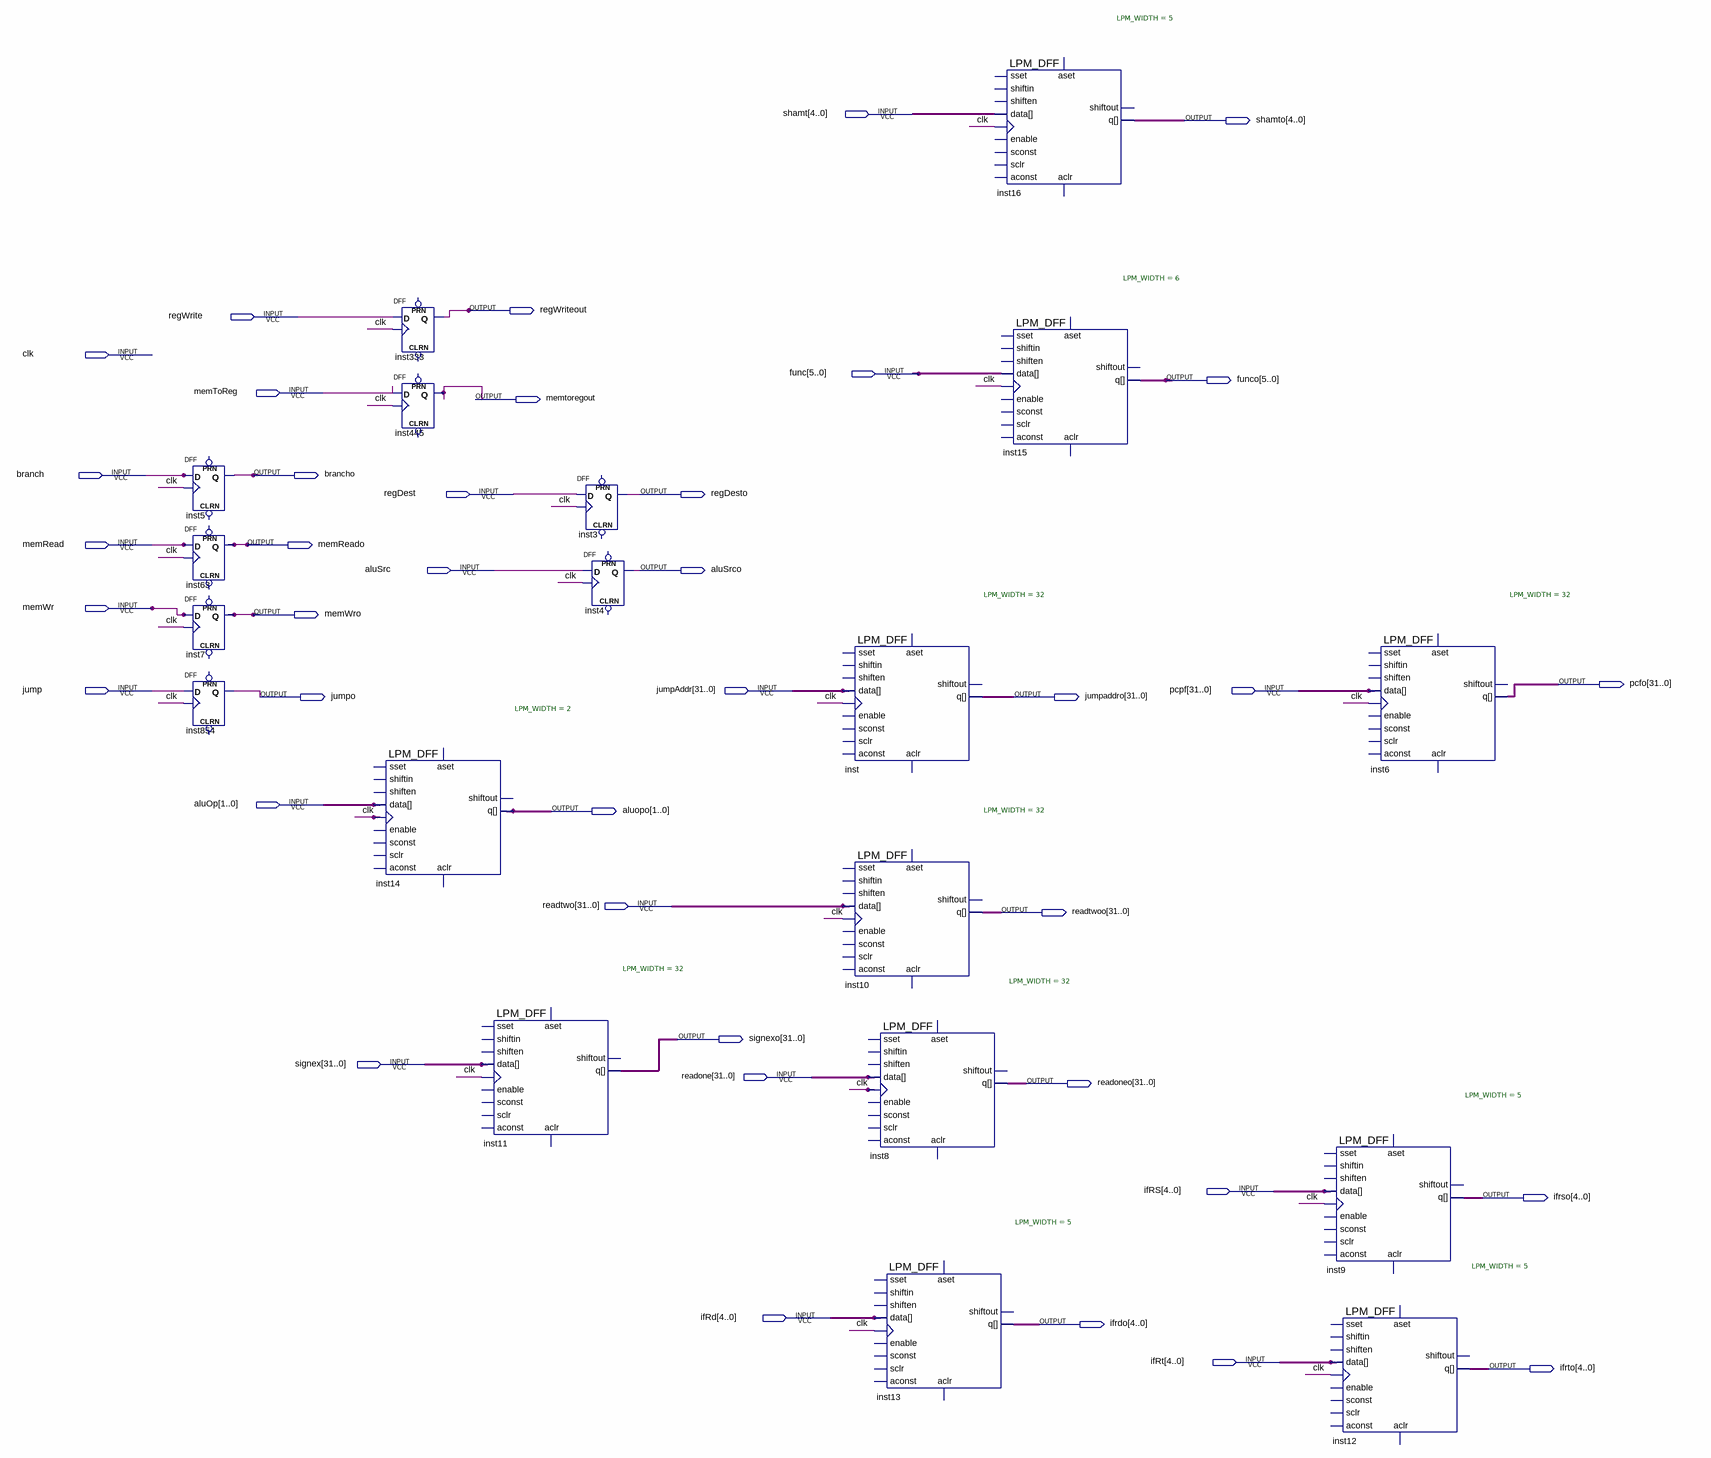
[diagram p0: schematic sheet]
// Quartus schematic Block3.bdf as structural Verilog: 19 symbols, 39 pins
module Block3 (
  input  [4:0] shamt,
  input  regWrite,
  input  clk,
  input  [5:0] func,
  input  memToReg,
  input  branch,
  input  regDest,
  input  memRead,
  input  aluSrc,
  input  memWr,
  input  jump,
  input  [31:0] jumpAddr,
  input  [31:0] pcpf,
  input  [1:0] aluOp,
  input  [31:0] readtwo,
  input  [31:0] signex,
  input  [31:0] readone,
  input  [4:0] ifRS,
  input  [4:0] ifRd,
  input  [4:0] ifRt,
  output [4:0] shamto,
  output regWriteout,
  output [5:0] funco,
  output memtoregout,
  output brancho,
  output regDesto,
  output memReado,
  output aluSrco,
  output memWro,
  output [31:0] pcfo,
  output jumpo,
  output [31:0] jumpaddro,
  output [1:0] aluopo,
  output [31:0] readtwoo,
  output [31:0] signexo,
  output [31:0] readoneo,
  output [4:0] ifrso,
  output [4:0] ifrdo,
  output [4:0] ifrto
);

  wire inst445_q;

  DFF inst5 (.CLK(clk), .D(branch), .Q(brancho));  // open: CLRN, PRN
  DFF inst63 (.CLK(clk), .D(memRead), .Q(memReado));  // open: CLRN, PRN
  DFF inst7 (.CLK(clk), .D(memWr), .Q(memWro));  // open: CLRN, PRN
  DFF inst854 (.CLK(clk), .D(jump), .Q(jumpo));  // open: CLRN, PRN
  LPM_DFF #(.LPM_WIDTH(2)) inst14 (
    .clock(clk), .data(aluOp), .q(aluopo));  // open: shiftin, shiften, enable, aconst, sclr, sconst, sset, aset, aclr, shiftout
  DFF inst333 (.CLK(clk), .D(regWrite), .Q(regWriteout));  // open: CLRN, PRN
  DFF inst445 (.CLK(clk), .D(memToReg), .Q(inst445_q));  // open: CLRN, PRN
  LPM_DFF #(.LPM_WIDTH(32)) inst11 (
    .clock(clk), .data(signex), .q(signexo));  // open: shiftin, shiften, enable, aconst, sclr, sconst, sset, aset, aclr, shiftout
  DFF inst3 (.CLK(clk), .D(regDest), .Q(regDesto));  // open: CLRN, PRN
  DFF inst4 (.CLK(clk), .D(aluSrc), .Q(aluSrco));  // open: CLRN, PRN
  LPM_DFF #(.LPM_WIDTH(32)) inst (
    .clock(clk), .data(jumpAddr), .q(jumpaddro));  // open: shiftin, shiften, enable, aconst, sclr, sconst, sset, aset, aclr, shiftout
  LPM_DFF #(.LPM_WIDTH(32)) inst10 (
    .clock(clk), .data(readtwo), .q(readtwoo));  // open: shiftin, shiften, enable, aconst, sclr, sconst, sset, aset, aclr, shiftout
  LPM_DFF #(.LPM_WIDTH(32)) inst8 (
    .clock(clk), .data(readone), .q(readoneo));  // open: shiftin, shiften, enable, aconst, sclr, sconst, sset, aset, aclr, shiftout
  LPM_DFF #(.LPM_WIDTH(5)) inst13 (
    .clock(clk), .data(ifRd), .q(ifrdo));  // open: shiftin, shiften, enable, aconst, sclr, sconst, sset, aset, aclr, shiftout
  LPM_DFF #(.LPM_WIDTH(5)) inst16 (
    .clock(clk), .data(shamt), .q(shamto));  // open: shiftin, shiften, enable, aconst, sclr, sconst, sset, aset, aclr, shiftout
  LPM_DFF #(.LPM_WIDTH(6)) inst15 (
    .clock(clk), .data(func), .q(funco));  // open: shiftin, shiften, enable, aconst, sclr, sconst, sset, aset, aclr, shiftout
  LPM_DFF #(.LPM_WIDTH(5)) inst9 (
    .clock(clk), .data(ifRS), .q(ifrso));  // open: shiftin, shiften, enable, aconst, sclr, sconst, sset, aset, aclr, shiftout
  LPM_DFF #(.LPM_WIDTH(5)) inst12 (
    .clock(clk), .data(ifRt), .q(ifrto));  // open: shiftin, shiften, enable, aconst, sclr, sconst, sset, aset, aclr, shiftout
  LPM_DFF #(.LPM_WIDTH(32)) inst6 (
    .clock(clk), .data(pcpf), .q(pcfo));  // open: shiftin, shiften, enable, aconst, sclr, sconst, sset, aset, aclr, shiftout
endmodule
